# EAGLE design power_hv (EAGLE 9.1.0)
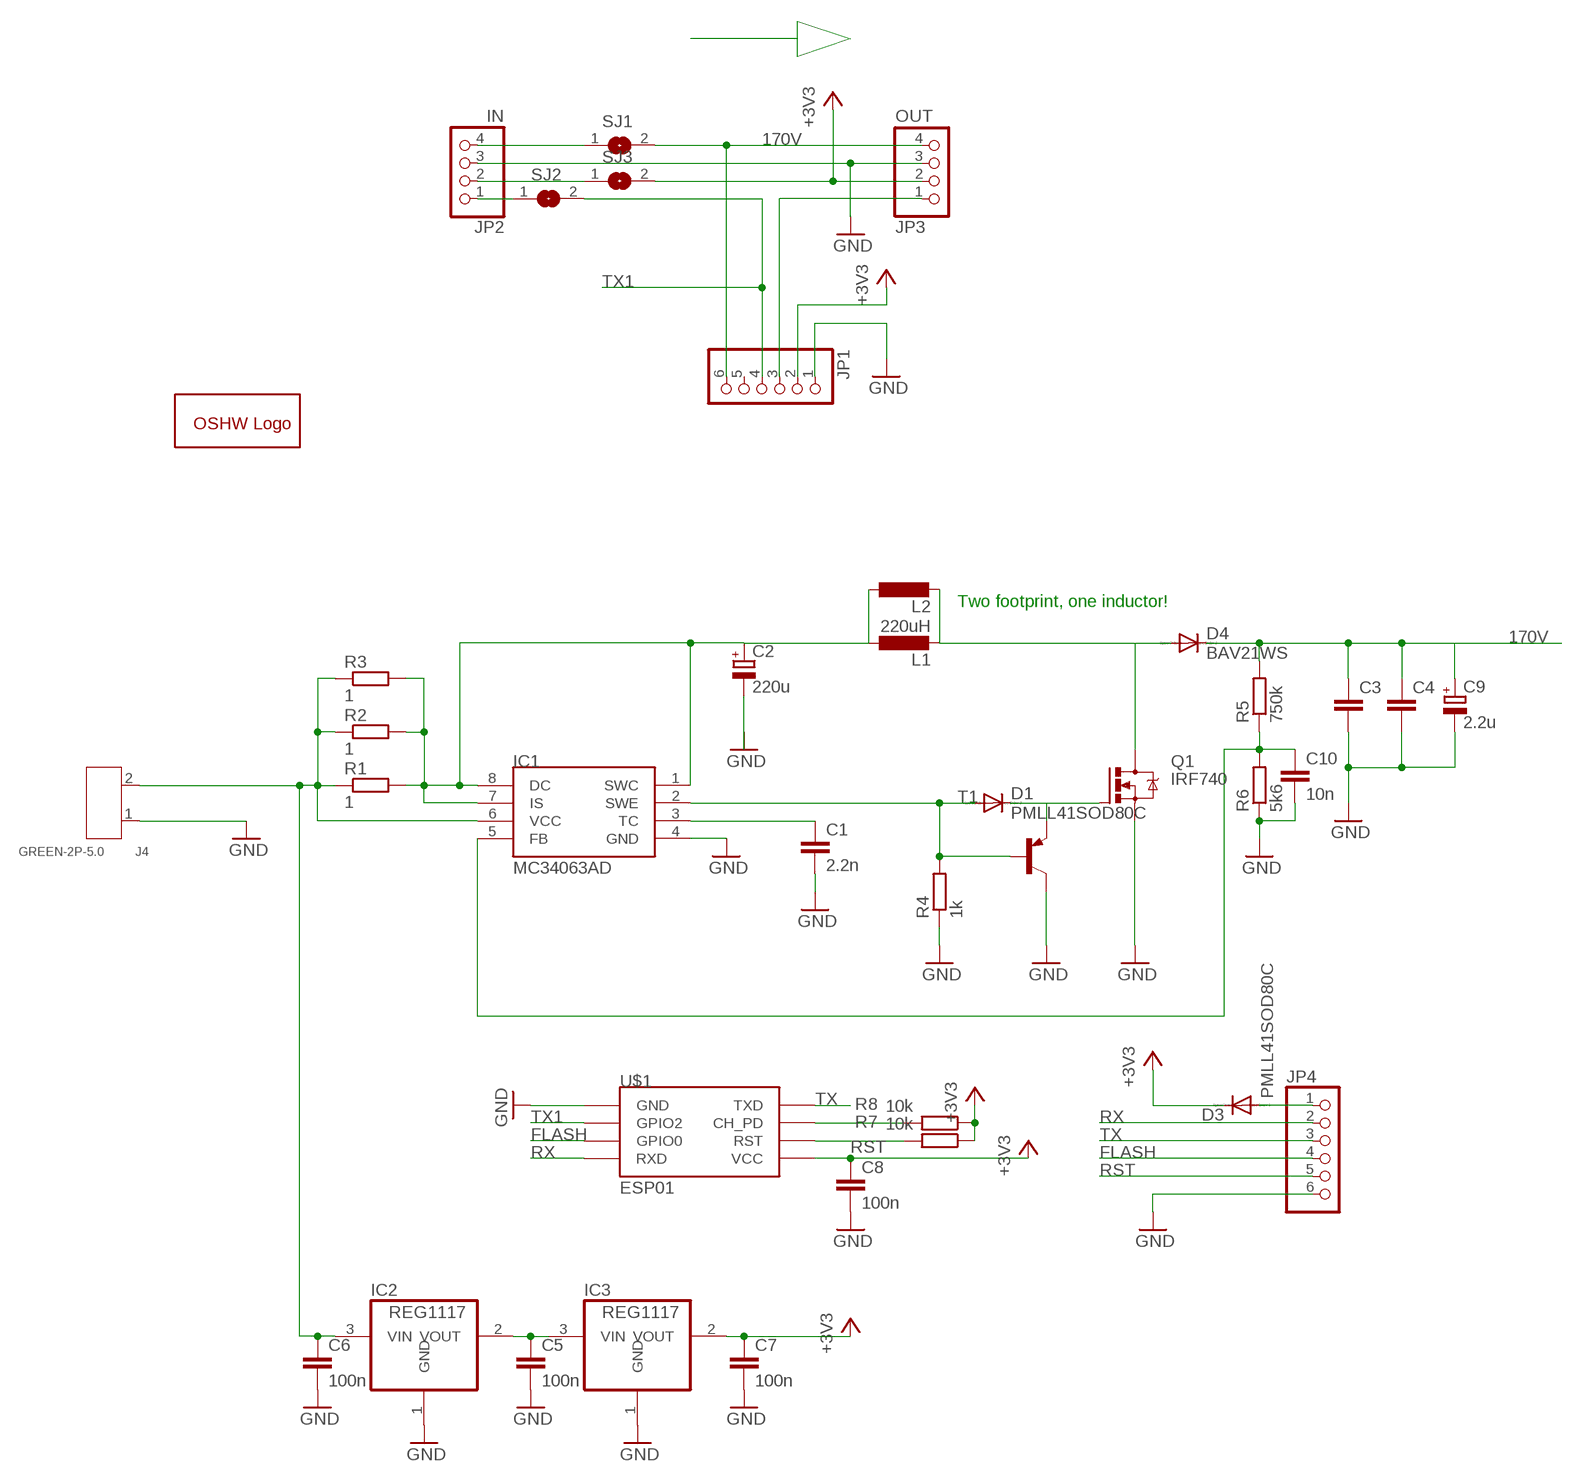
[diagram p0: schematic, sheet 1]

## Parts
C1  2.2n  C-EUC0805  [C0805]
C2  220u  CPOL-EU140CLH-0810  [140CLH-0810]
C3  C-EUC1210K  [C1210K]
C4  C-EUC1210K  [C1210K]
C5  100n  C-EUC0805  [C0805]
C6  100n  C-EUC0805  [C0805]
C7  100n  C-EUC0805  [C0805]
C8  100n  C-EUC0805  [C0805]
C9  2.2u  CPOL-EUE5-8.5  [E5-8,5]
C10  10n  C-EUC0805  [C0805]
D1  PMLL41SOD80C  [SOD80C]
D3  PMLL41SOD80C  [SOD80C]
D4  BAV21WS  DIODE-SOD323-W  [SOD323-W]
GOLD_ORB_SM1  OSHWLOGOLOGO8MM  [OSHW_8MM]
IC1  MC34063AD  [SOIC8]
IC2  REG1117  [SOT223]
IC3  REG1117  [SOT223]
J4  GREEN-2P-5.0  SCREW-TERMINAL-GREEN(2P-5.0)  [H2-5.0-10.5X8.0MM]
JP1  PINHD-1X6  [1X06]
JP2  IN  PINHD-1X4  [1X04]
JP3  OUT  PINHD-1X4  [1X04]
JP4  PINHD-1X6  [1X06]
L1  220uH  L-EUWE-TPC  [POWER-CHOKE_WE-TPC]
L2  L-EU6000-XXX-RC  [6000-XXXX-RC]
Q1  IRF740  [TO220BV]
R1  1  R-EU_R0805  [R0805]
R2  1  R-EU_R0805  [R0805]
R3  1  R-EU_R0805  [R0805]
R4  1k  R-EU_R0805  [R0805]
R5  750k  R-EU_R0805  [R0805]
R6  5k6  R-EU_R0805  [R0805]
R7  10k  R-EU_R0805  [R0805]
R8  10k  R-EU_R0805  [R0805]
SJ1  SJ  [SJ]
SJ2  SJ  [SJ]
SJ3  SJ  [SJ]
T1  BC807-40-PNP-SOT23-BEC  [SOT23-BEC]
U$1  ESP01  [ESP01]

## Nets
170V [HV]: C3.1 C4.1 C9.+ D4.C JP1.6 JP3.4 R5.2 SJ1.2
+3V3: C7.1 C8.1 D3.C IC3.2(VOUT) JP1.2 JP3.2 R7.1 R8.1 SJ3.2 U$1.VCC
FLASH: JP4.4 U$1.GPIO0
GND: C1.2 C2.- C3.2 C4.2 C5.2 C6.2 C7.2 C8.2 C9.- C10.2 IC1.4(GND) IC2.1(GND) IC3.1(GND) J4.1 JP1.1 JP2.3 JP3.3 JP4.6 Q1.S R4.1 R6.1 T1.C U$1.GND
N$1: C2.+ IC1.1(SWC) IC1.7(IS) IC1.8(DC) L1.1 L2.1 R1.2 R2.2 R3.2
N$2: D1.A IC1.2(SWE) R4.2 T1.B
N$3: C1.1 IC1.3(TC)
N$4: JP1.3 JP3.1
N$5: C6.1 IC1.6(VCC) IC2.3(VIN) J4.2 R1.1 R2.1 R3.1
N$6: D1.C Q1.G T1.E
N$7 [HV]: D4.A L1.2 L2.2 Q1.D
N$8: C10.1 IC1.5(FB) R5.1 R6.2
N$10: C5.1 IC2.2(VOUT) IC3.3(VIN)
N$12: R8.2 U$1.CH_PD
N$13: D3.A JP4.1
N$14 [HV]: JP2.4 SJ1.1
N$15: JP2.2 SJ3.1
N$16: JP2.1 SJ2.1
RST: JP4.5 R7.2 U$1.RST
RX: JP4.2 U$1.RX(RXD)
TX: JP4.3 U$1.TX(TXD)
TX1: JP1.4 SJ2.2 U$1.GPIO2
Unconnected: JP1.5

## Notes on the sheet
- Two footprint, one inductor!

## Library data of the parts
C1 C5-C8 C10 = resistor:C-EU: CAPACITOR, European symbol
C2 = rcl:CPOL-EU: POLARIZED CAPACITOR, European symbol; SPICEPREFIX: C
C3 C4 = rcl:C-EU: CAPACITOR, European symbol; SPICEPREFIX: C
C9 = resistor:CPOL-EU: POLARIZED CAPACITOR, European symbol
D1 D3 = diode:PMLL41*: High-speed diodes Source: http://www.semiconductors.philips.com/acrobat_download/datasheets/PMLL4150_2.pdf
D4 = diode:DIODE-: DIODE
GOLD_ORB_SM1 = oshw:OSHWLOGO: The OSHW logo for PCB layout
IC1 = mc34063:MC34063
IC2 IC3 = burr-brown:REG1117: 800mA and 1A Low Dropout (LDO) Positive Regulator 1.8V, 2.5V, 2.85V, 3.3V, 5V, and Adj; MPN: REG1117; OC_FARNELL: 1097566; OC_NEWARK: 14P6981
J4 = Seeed-Connector:SCREW-TERMINAL-GREEN(2P-5.0): 320110031
JP1 JP4 = pinhead:PINHD-1X6: PIN HEADER
JP2 JP3 = pinhead:PINHD-1X4: PIN HEADER
L1 L2 = rcl:L-EU: INDUCTOR, European symbol; SPICEPREFIX: L
Q1 = transistor-power:IRF740: N-CHANNEL MOS FET
R1-R8 = resistor:R-EU_: RESISTOR, European symbol
SJ1-SJ3 = jumper:SJ: SMD solder JUMPER
T1 = transistor:*-PNP-: PNP Transistror
U$1 = esp8266modules:ESP01: ESP8266 Wifi module 01

## Net classes
1 HV: clearance 0.508 mm

## Board
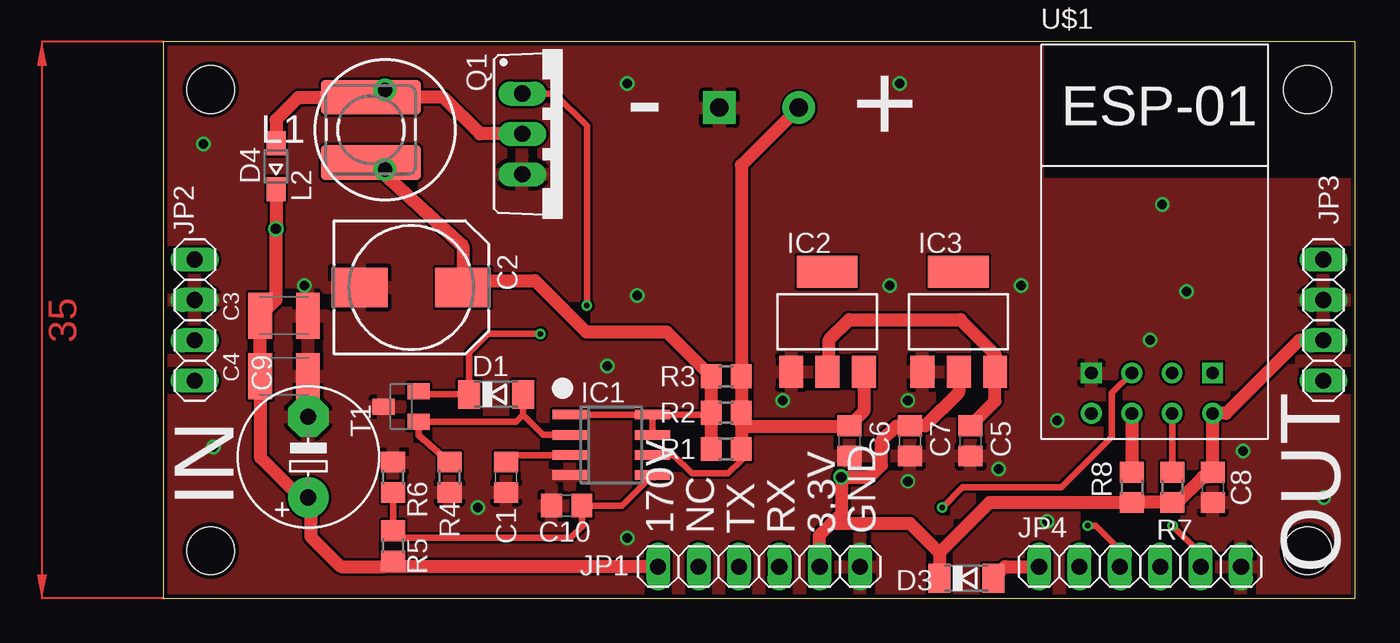
[diagram p1: board, top side]
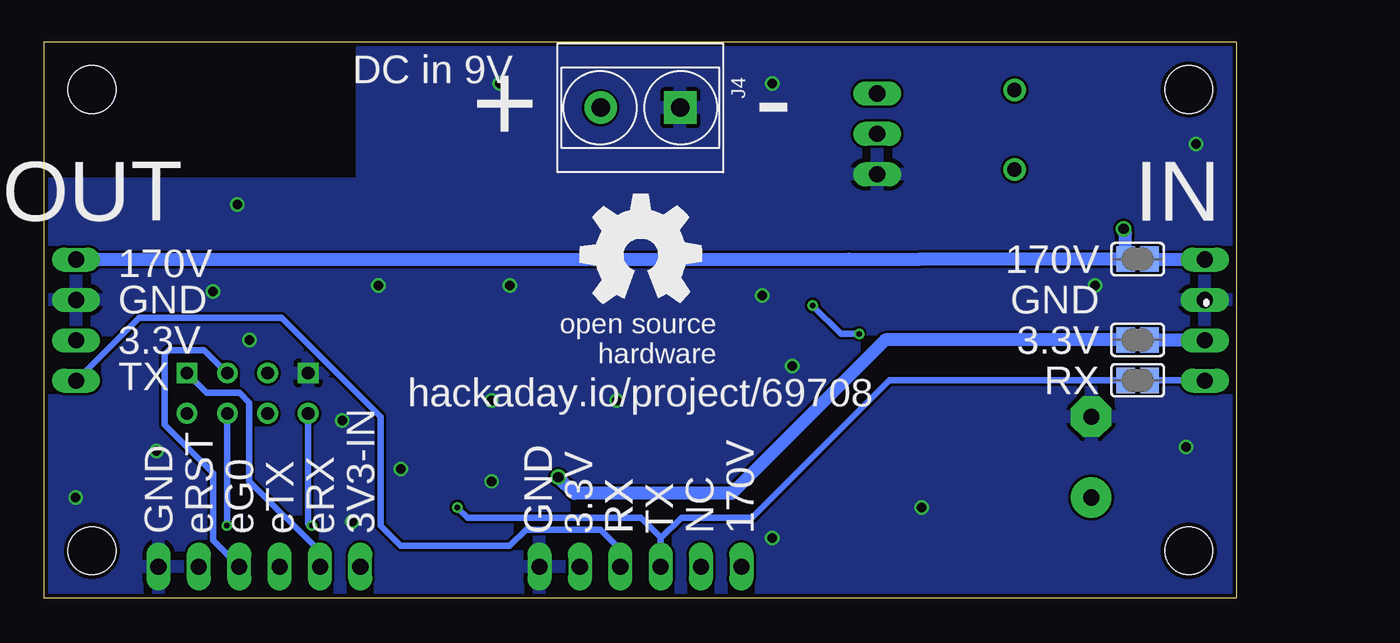
[diagram p2: board, bottom side, seen from below]

Size 75 x 35 mm. Coordinates in mm from the lower left corner, seen from the top.
Outline: 0,0 75,0 75,35 0,35 0,0
Copper layers (1*16): Top 0.035mm / dielectric 1.5mm / Bottom 0.035mm
Design rules "SeeedStudio_2layer_DRU_no_angle_20140221": minimum track width 6mil, minimum drill 12mil, track to track 6mil, track to pad 6mil, pad to pad 6mil, via to via 6mil, smd to smd 0mil, copper to edge 10mil, drill to drill 10mil, minimum pad ring 10mil, minimum via ring 6mil, stop-mask expansion 2mil, vias tented up to drill 100mil, thermal gap 10mil
Holes 3 mm at 3,32 72,32 72,3 3,3

### Footprints (pad centres in the part's own frame; a part is rotated, then mirrored left to right if it is on the bottom)
C0805 = smd 1.3 x 1.5: 1 -0.95,0; 2 0.95,0
140CLH-0810 = smd 3.5 x 2.5: + 3.25,0; - -3.25,0
C1210K = smd 1.5 x 2.9: 1 -1.5,0; 2 1.5,0
E5-8,5 = drill 1.016 pad 2.54: + -2.54,0 | drill 1.016 pad 2.54 octagon: - 2.54,0
SOD80C = smd 1.4 x 1.8: A 1.7,0; C -1.7,0
SOD323-W = smd 1.5 x 1.2: A 1.45,0; C -1.45,0
SOIC8 = smd 0.6 x 2.2: 1 -1.905,-2.6; 2 -0.635,-2.6; 3 0.635,-2.6; 4 1.905,-2.6; 5 1.905,2.6; 6 0.635,2.6; 7 -0.635,2.6; 8 -1.905,2.6
SOT223 = smd 1.499 x 2.007: 1 -2.261,-3.15; 2 0.025,-3.15; 3 2.311,-3.15 | smd 3.81 x 2.007: 4 0,3.15
H2-5.0-10.5X8.0MM = drill 1.168 pad 2.032 square: 1 0,2.5 | drill 1.168 pad 2.032: 2 0,-2.5
1X06 = drill 1.016 long: 1 -6.35,0; 2 -3.81,0; 3 -1.27,0; 4 1.27,0; 5 3.81,0; 6 6.35,0
1X04 = drill 1.016 long: 1 -3.81,0; 2 -1.27,0; 3 1.27,0; 4 3.81,0
POWER-CHOKE_WE-TPC = smd 6.3 x 2.2: 1 0,2.05; 2 0,-2.05
6000-XXXX-RC = drill 0.9 pad 1.422: 1 -2.5,0; 2 2.5,0
TO220BV = drill 1.016 long: D 0,-2.54; G -2.54,-2.54; S 2.54,-2.54
R0805 = smd 1.3 x 1.5: 1 -0.95,0; 2 0.95,0
SJ = smd 1.168 x 1.6: 1 -0.762,0; 2 0.762,0
SOT23-BEC = smd 1 x 1.4: B -0.95,-1.1; C 0,1.1; E 0.95,-1.1
ESP01 = drill 0.8: CH_PD -1.285,-8.178; GPIO0 1.255,-5.638; GPIO2 -1.285,-5.638; RST 1.255,-8.178; TX -3.825,-8.178; VCC 3.795,-8.178 | drill 0.8 square: GND -3.825,-5.638; RX 3.795,-5.638

### Placement (x,y rotation side)
C1  21.59,7.62 270 top
C2  15.62,19.56 0 top
C3  7.62,17.78 0 top
C4  7.62,13.97 0 top
C5  50.8,9.91 270 top
C6  43.18,9.91 270 top
C7  46.99,9.91 270 top
C8  66.04,6.99 270 top
C9  9.14,8.89 90 top
C10  25.4,5.84 180 top
D1  20.95,12.83 0 top
D3  50.55,1.27 0 top
D4  7.11,27.18 90 top
GOLD_ORB_SM1  37.5,21.59 0 bottom
IC1  28.19,9.65 270 top
IC2  41.78,17.4 0 top
IC3  50.04,17.4 0 top
J4  37.5,30.86 270 bottom
JP1  37.5,2 180 top
JP2  2,17.5 90 top
JP3  73,17.5 90 top
JP4  61.47,2 0 top
L1  13.08,29.46 180 top
L2  13.97,29.46 90 top
Q1  25.15,29.21 270 top
R1  35.43,9.4 180 top
R2  35.43,11.68 180 top
R3  35.43,13.97 180 top
R4  18.03,7.62 90 top
R5  14.48,3.3 270 top
R6  14.48,7.62 270 top
R7  63.5,6.99 90 top
R8  60.96,6.99 90 top
SJ1  6.22,21.34 180 bottom
SJ2  6.22,13.72 180 bottom
SJ3  6.22,16.26 180 bottom
T1  14.99,12.06 90 top
U$1  62.23,19.81 0 top

### Tracks (layer width: path | path; a pad name or v marks a point on that pad's centre or on a via)
170V  (via drill 0.65)
  Top 0.152: R5.2 13.97,2
  Top 0.813: JP1.6 13.97,2 11.18,2 9.3,3.88 9.3,6.19 C9.+ 8.64,6.35 6.12,8.87 C4.1 C3.1 7.11,18.77 v7.11,23.24 D4.C
  Bottom 0.813: 24.41,21.31 41.66,21.31 JP3.4 | 24.38,21.34 24.41,21.31 | 24.41,21.31 19.96,21.31 19.94,21.34 SJ1.2 6.99,22.99 7.11,23.11 v7.11,23.24
+3V3  (via drill 0.65)
  Top 0.813: 42.04,4.7 42.67,5.33 v42.67,7.62 44.45,7.62 45.21,8.38 45.21,9.91 46.16,10.86 C7.1 47.94,10.86 50.06,12.98 IC3.2 | 42.04,4.7 41.27,3.94 41.27,2.04 JP1.2 | JP3.2 71.47,16.23 66.88,11.63 U$1.VCC 66.04,11.62 C8.1 65.72,7.62 65.41,7.62 63.82,6.04 R7.1 R8.1 52.01,6.04 48.85,2.87 | 48.85,2.87 D3.C | 48.85,2.87 47.02,4.7 42.04,4.7
  Bottom 0.813: SJ3.2 22.1,16.26 31.75,6.6 41.66,6.6 v42.67,7.62
FLASH
  Bottom 0.406: U$1.GPIO0 64.93,15.62 67.18,15.62 67.44,15.37 67.44,10.92 64.39,7.87 64.39,3.65 JP4.4
GND  (via drill 0.6)
  other vias: 2.54,28.57 3.17,9.53 8.89,19.68 29.21,32.38 46.35,32.38 19.81,5.71 29.21,3.81 27.94,14.61 29.84,19.05 52.58,8.13 62.87,24.77 73.03,6.35 45.72,19.68 53.98,19.68 38.99,12.45 56.26,11.18 67.94,9.27 55.63,4.83 62.1,16.26 64.39,19.3 46.86,12.45 46.86,7.37
  pour Top: -1.27,34.8 54.99,34.8 54.99,26.04 77.47,26.04 77.47,0 -1.27,0
  pour Bottom: -1.27,34.8 54.99,34.8 54.99,26.04 77.47,26.04 77.47,0 -1.27,0
N$1
  Top 0.406: IC1.1 IC1.8 | IC1.8 IC1.7 | IC1.8 34.36,11.56 34.48,9.91
  Top 0.813: R1.2 34.48,9.91 R2.2 R3.2 31.69,16.76 26.62,16.76 23.39,19.99 20.19,19.99 19.76,19.56 C2.+ 18.87,22.13 L1.1 13.52,27.41 L2.1
N$2
  Top 0.406: IC1.2 23.93,10.29 22.66,11.56 | D1.A 22.66,11.56 | 22.66,11.56 22.21,11.12 T1.B 16.09,10.26 R4.2
N$3
  Top 0.406: IC1.3 22.04,9.02 C1.1
N$4
  Bottom 0.406: JP3.1 69.04,17.65 60.07,17.65 53.85,11.43 53.85,4.57 52.58,3.3 45.72,3.3 44.7,4.32 40.01,4.32 38.77,3.08 JP1.3
N$5
  Top 0.406: 36.32,10.16 36.32,11.12 R1.1 36.38,8.7 35.56,7.87 33.27,7.87 32.13,9.02 IC1.6
  Top 0.813: 36.38,10.92 R2.1 R3.1 36.38,27.24 J4.2 | 36.38,10.92 R1.1 | IC2.3 44.09,11.77 C6.1 43.12,10.79 36.51,10.79 36.38,10.92
N$6  (via drill 0.35)
  Top 0.406: 19.25,12.9 D1.C | T1.E 16.27,12.83 D1.C | D1.C 19.25,15.45 20.45,16.64 v23.75,16.64 | Q1.G 24.64,31.75 26.67,29.72 v26.67,18.41
  Bottom 0.406: v23.75,16.64 24.89,16.64 v26.67,18.41
N$7
  Top 0.813: Q1.D 19.94,29.21 17.64,31.51 L1.2 | L1.2 8.53,31.51 7.11,30.1 D4.A | L1.2 13.52,31.51 L2.2
N$8
  Top 0.406: 14.48,4.32 14.48,4.57 R6.2 | 30.92,7.62 IC1.5 28.89,5.84 26.67,5.84 26.35,5.52 | C10.1 26.35,5.52 | R5.1 14.48,4.32 | 14.48,4.32 14.48,3.81 25.65,3.81 26.42,4.57 26.35,4.64 26.35,5.52
N$10
  Top 0.813: C5.1 52.35,12.4 IC3.3 52.35,15.34 50.16,17.53 43.18,17.53 41.91,16.26 41.91,14.35 IC2.2
N$12
  Top 0.813: U$1.CH_PD 60.95,7.95 R8.2
N$13
  Top 0.813: D3.A 52.98,2 JP4.1
N$14
  Bottom 0.813: SJ1.1 2.03,21.34 JP2.4
N$15
  Bottom 0.813: JP2.2 5.43,16.23 SJ3.1
N$16
  Bottom 0.406: SJ2.1 2.03,13.72 JP2.1
RST  (via drill 0.35)
  Top 0.406: U$1.RST 63.48,7.95 R7.2 | JP4.5 65.28,2.79 v63.5,4.57
  Bottom 0.406: v63.5,4.57 63.5,11.62 U$1.RST
RX
  Bottom 0.406: U$1.RX 64.77,12.92 62.7,12.92 62.1,12.32 62.1,7.37 57.66,2.92 JP4.2
TX  (via drill 0.35)
  Top 0.406: v58.17,4.57 58.67,4.57 60.2,3.05 JP4.3
  Bottom 0.406: U$1.TX 58.41,4.68 58.29,4.57 v58.17,4.57
TX1  (via drill 0.35)
  Top 0.406: U$1.GPIO2 59.69,12.92 59.69,10.16 56.52,6.99 50.29,6.99 v49.02,5.71
  Bottom 0.406: 36.23,3.77 JP1.4 | 36.23,3.77 34.92,5.08 30.48,5.08 21.84,13.72 SJ2.2 | v49.02,5.71 48.39,5.08 37.47,5.08 36.23,3.85 36.23,3.77
(copper drawn outside any net)
  shapes: Top area x1

### Text on the board
tNames: - | + | OUT | IN | 170V | NC | TX | RX | 3.3V | GND
bNames: DC in 9V | - | + | IN | OUT | 170V | 170V | GND | GND | 3.3V | 3.3V | RX | TX | hackaday.io/project/69708 | 170V | NC | TX | RX | RX | 3.3V | GND | GND | 3V3-IN | eRX | eTX | eG0 | eRST | GND